# EAGLE design 5v dual power supply (EAGLE 9.6.2)
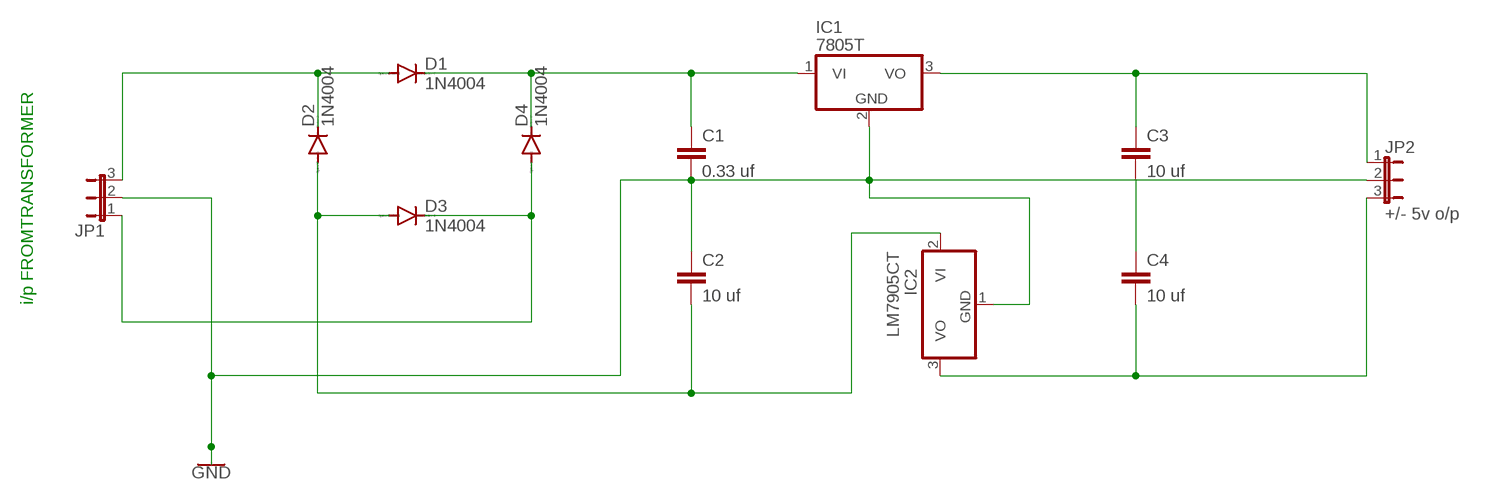
[diagram p0: schematic, sheet 1]

## Parts
C1  0.33 uf  C2,5-3  [C2.5-3]
C2  10 uf  C2,5-3  [C2.5-3]
C3  10 uf  C2,5-3  [C2.5-3]
C4  10 uf  C2,5-3  [C2.5-3]
D1  1N4004  [DO41-10]
D2  1N4004  [DO41-10]
D3  1N4004  [DO41-10]
D4  1N4004  [DO41-10]
IC1  7805T  [TO220H]
IC2  LM7905CT  7905T  [TO220H]
JP1  JP2E  [JP2]
JP2  +/- 5v o/p  JP2E  [JP2]

## Nets
GND: C1.2 C2.1 IC1.2(GND) IC2.1(GND) JP1.2 JP2.2
N$1: C1.1 D1.C D4.C IC1.1(VI)
N$2: D3.C D4.A JP1.1
N$3: D1.A D2.C JP1.3
N$4: C2.2 D2.A D3.A IC2.2(VI)
N$6: C3.1 IC1.3(VO) JP2.1
N$7: C3.2 C4.1
N$9: C4.2 IC2.3(VO) JP2.3

## Notes on the sheet
- i/p FROMTRANSFORMER

## Library data of the parts
C1-C4 = capacitor-wima:C: CAPACITOR naming: grid - package width
D1-D4 = diode:1N4004: DIODE general purpose rectifier, 1 A
IC1 = linear:78*: Positive VOLTAGE REGULATOR Source: http://cache.national.com/ds/LM/LM78L05.pdf http://www.fairchildsemi.com/ds/LM/LM7805.pdf
IC2 = linear:79*: Negative VOLTAGE REGULATOR
JP1 JP2 = jumper:JP2E: JUMPER

## Board
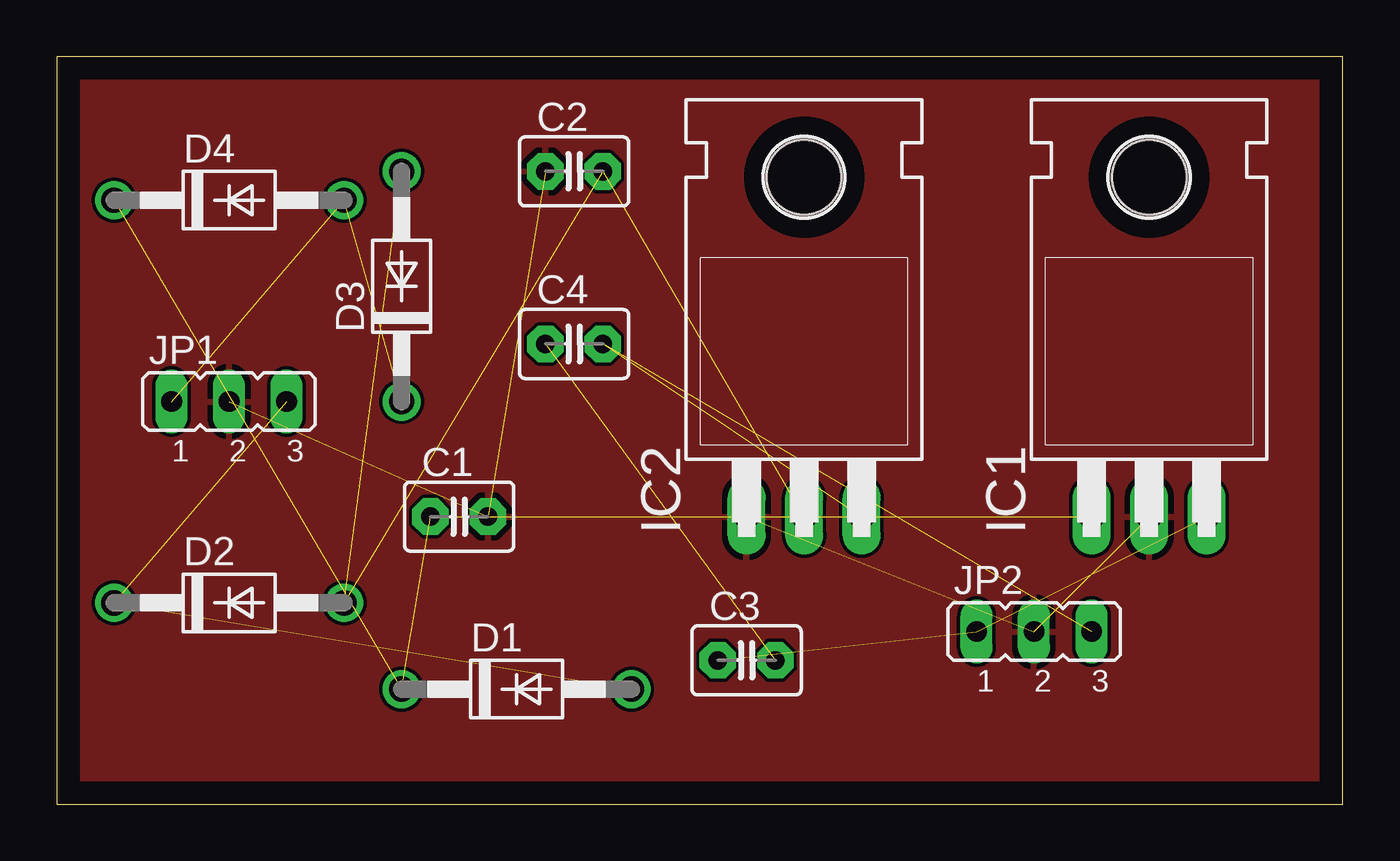
[diagram p1: board, top side]
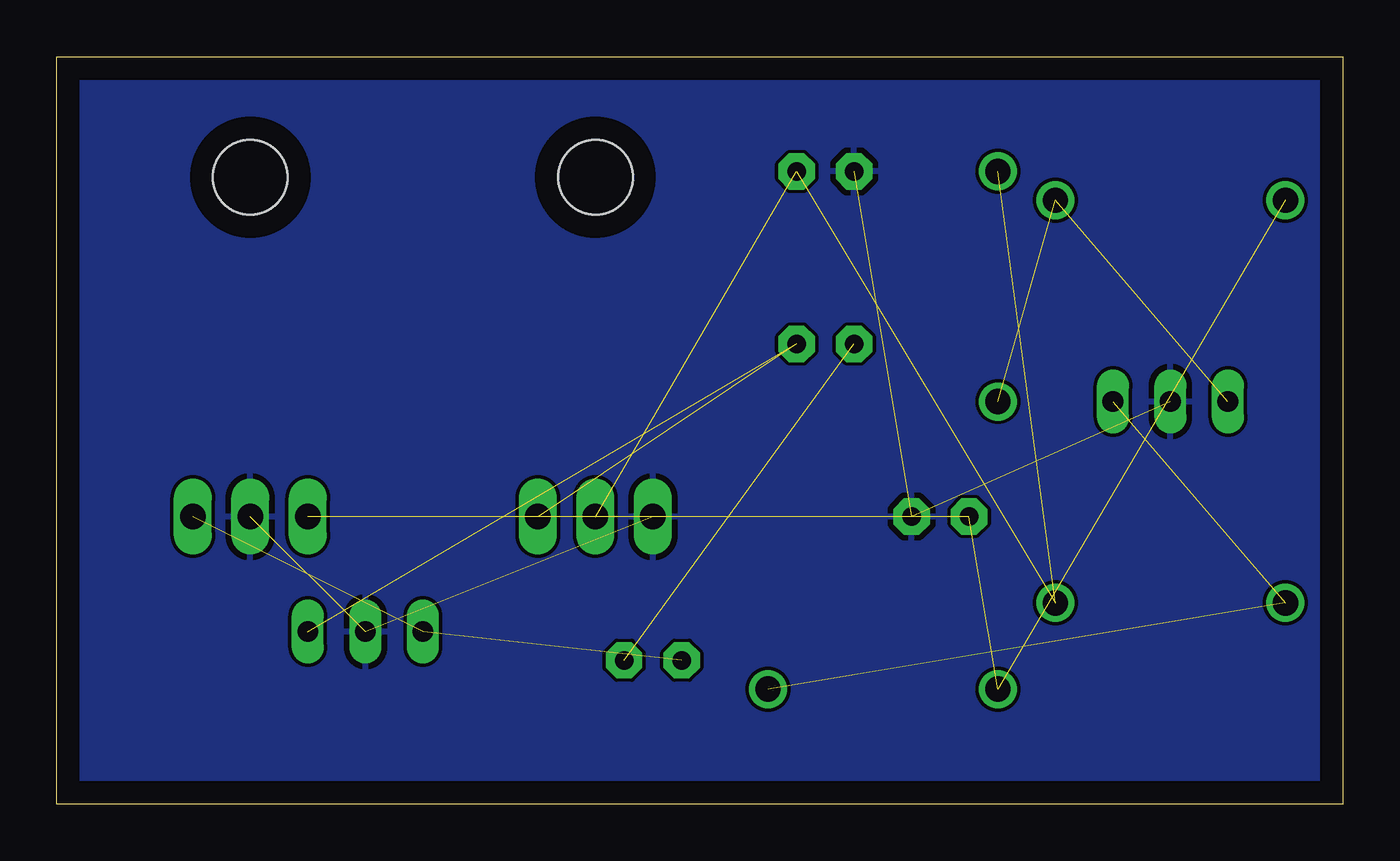
[diagram p2: board, bottom side, seen from below]

Size 56.82 x 33.01 mm. Coordinates in mm from the lower left corner, seen from the top.
Outline: 0,0 56.82,0 56.82,33.01 0,33.01 0,0
Copper layers (1*16): Top 0.035mm / dielectric 1.5mm / Bottom 0.035mm
Design rules "default": minimum track width 6mil, minimum drill 0.35mm, track to track 6mil, track to pad 6mil, pad to pad 6mil, via to via 6mil, smd to smd 6mil, copper to edge 40mil, drill to drill 6mil, minimum pad ring 10mil, minimum via ring 8mil, stop-mask expansion 4mil, vias tented up to drill 0mil, thermal gap 10mil

### Footprints (pad centres in the part's own frame; a part is rotated, then mirrored left to right if it is on the bottom)
C2.5-3 = drill 0.813 pad 1.6 octagon: 1 -1.27,0; 2 1.27,0
DO41-10 = drill 1.118: A 5.08,0; C -5.08,0
TO220H = drill 1.118 long: 1 -2.54,-10.16; 2 0,-10.16; 3 2.54,-10.16 | hole 3.302: 0,4.826
JP2 = drill 0.914 long: 1 -2.54,0; 2 0,0; 3 2.54,0

### Placement (x,y rotation side)
C1  17.78,12.7 0 top
C2  22.86,27.94 0 top
C3  30.48,6.35 0 top
C4  22.86,20.32 0 top
D1  20.32,5.08 0 top
D2  7.62,8.89 0 top
D3  15.24,22.86 90 top
D4  7.62,26.67 0 top
IC1  48.26,22.86 0 top
IC2  33.02,22.86 0 top
JP1  7.62,17.78 0 top
JP2  43.18,7.62 0 top

### Tracks (layer width: path | path; a pad name or v marks a point on that pad's centre or on a via)
GND  (5 unrouted)
  pour Bottom: -3.81,36.83 60.96,36.83 60.96,-3.81 -3.81,-3.81
  pour Top: -1.27,35.56 58.42,35.56 58.42,-1.27 -1.27,-1.27
N$1  (3 unrouted)
N$2  (2 unrouted)
N$3  (2 unrouted)
N$4  (3 unrouted)
N$6  (2 unrouted)
N$7  (1 unrouted)
N$9  (2 unrouted)